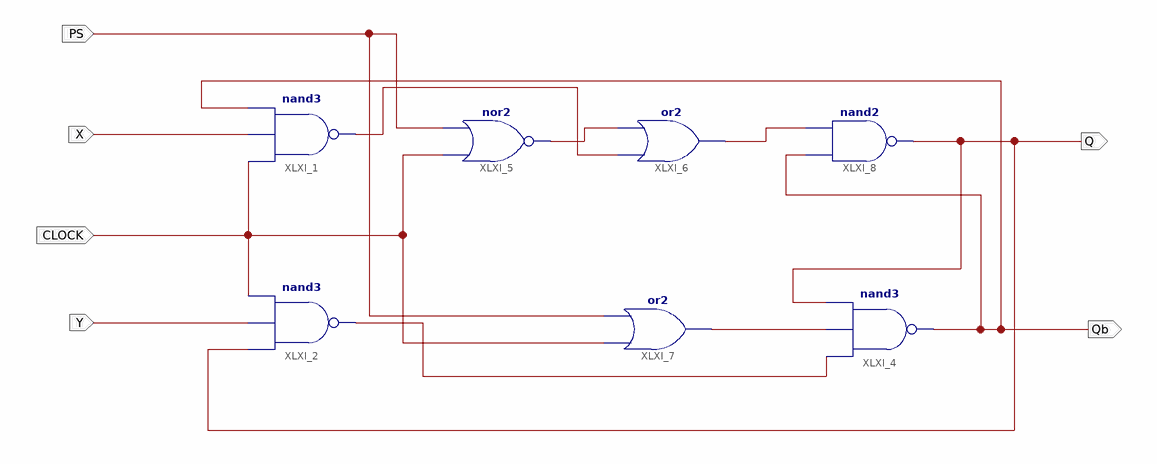
[diagram p0: schematic sheet 1]
// Xilinx ISE schematic JK_Latch_Syn.sch (artix7) as structural Verilog: 7 symbols, 6 ports
module JK_Latch_Syn (
  input  CLOCK,
  input  X,
  input  Y,
  input  PS,
  output Qb,
  output Q
);

  wire XLXN_3, XLXN_4, XLXN_5, XLXN_8, XLXN_18;

  nand XLXI_1 (XLXN_18, CLOCK, X, Qb);
  nand XLXI_2 (XLXN_8, Q, Y, CLOCK);
  nand XLXI_4 (Qb, XLXN_8, XLXN_5, Q);
  nor XLXI_5 (XLXN_3, CLOCK, PS);
  or XLXI_6 (XLXN_4, XLXN_18, XLXN_3);
  or XLXI_7 (XLXN_5, CLOCK, PS);
  nand XLXI_8 (Q, Qb, XLXN_4);
endmodule
